# EAGLE schematic uart_extension_adapter (EAGLE 7.5.0)
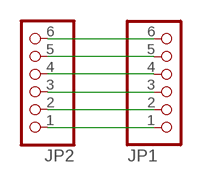
[diagram p0: schematic, sheet 1]

## Parts
JP1  PINHD-1X6  [1X06]
JP2  PINHD-1X6  [1X06]

## Nets
N$1: JP1.5 JP2.5
N$2: JP1.4 JP2.4
N$3: JP1.6 JP2.6
N$4: JP1.3 JP2.3
N$5: JP1.2 JP2.2
N$6: JP1.1 JP2.1

## Library data of the parts
JP1 JP2 = pinhead:PINHD-1X6: PIN HEADER